# EAGLE design StepDown_V1 (EAGLE 6.1)
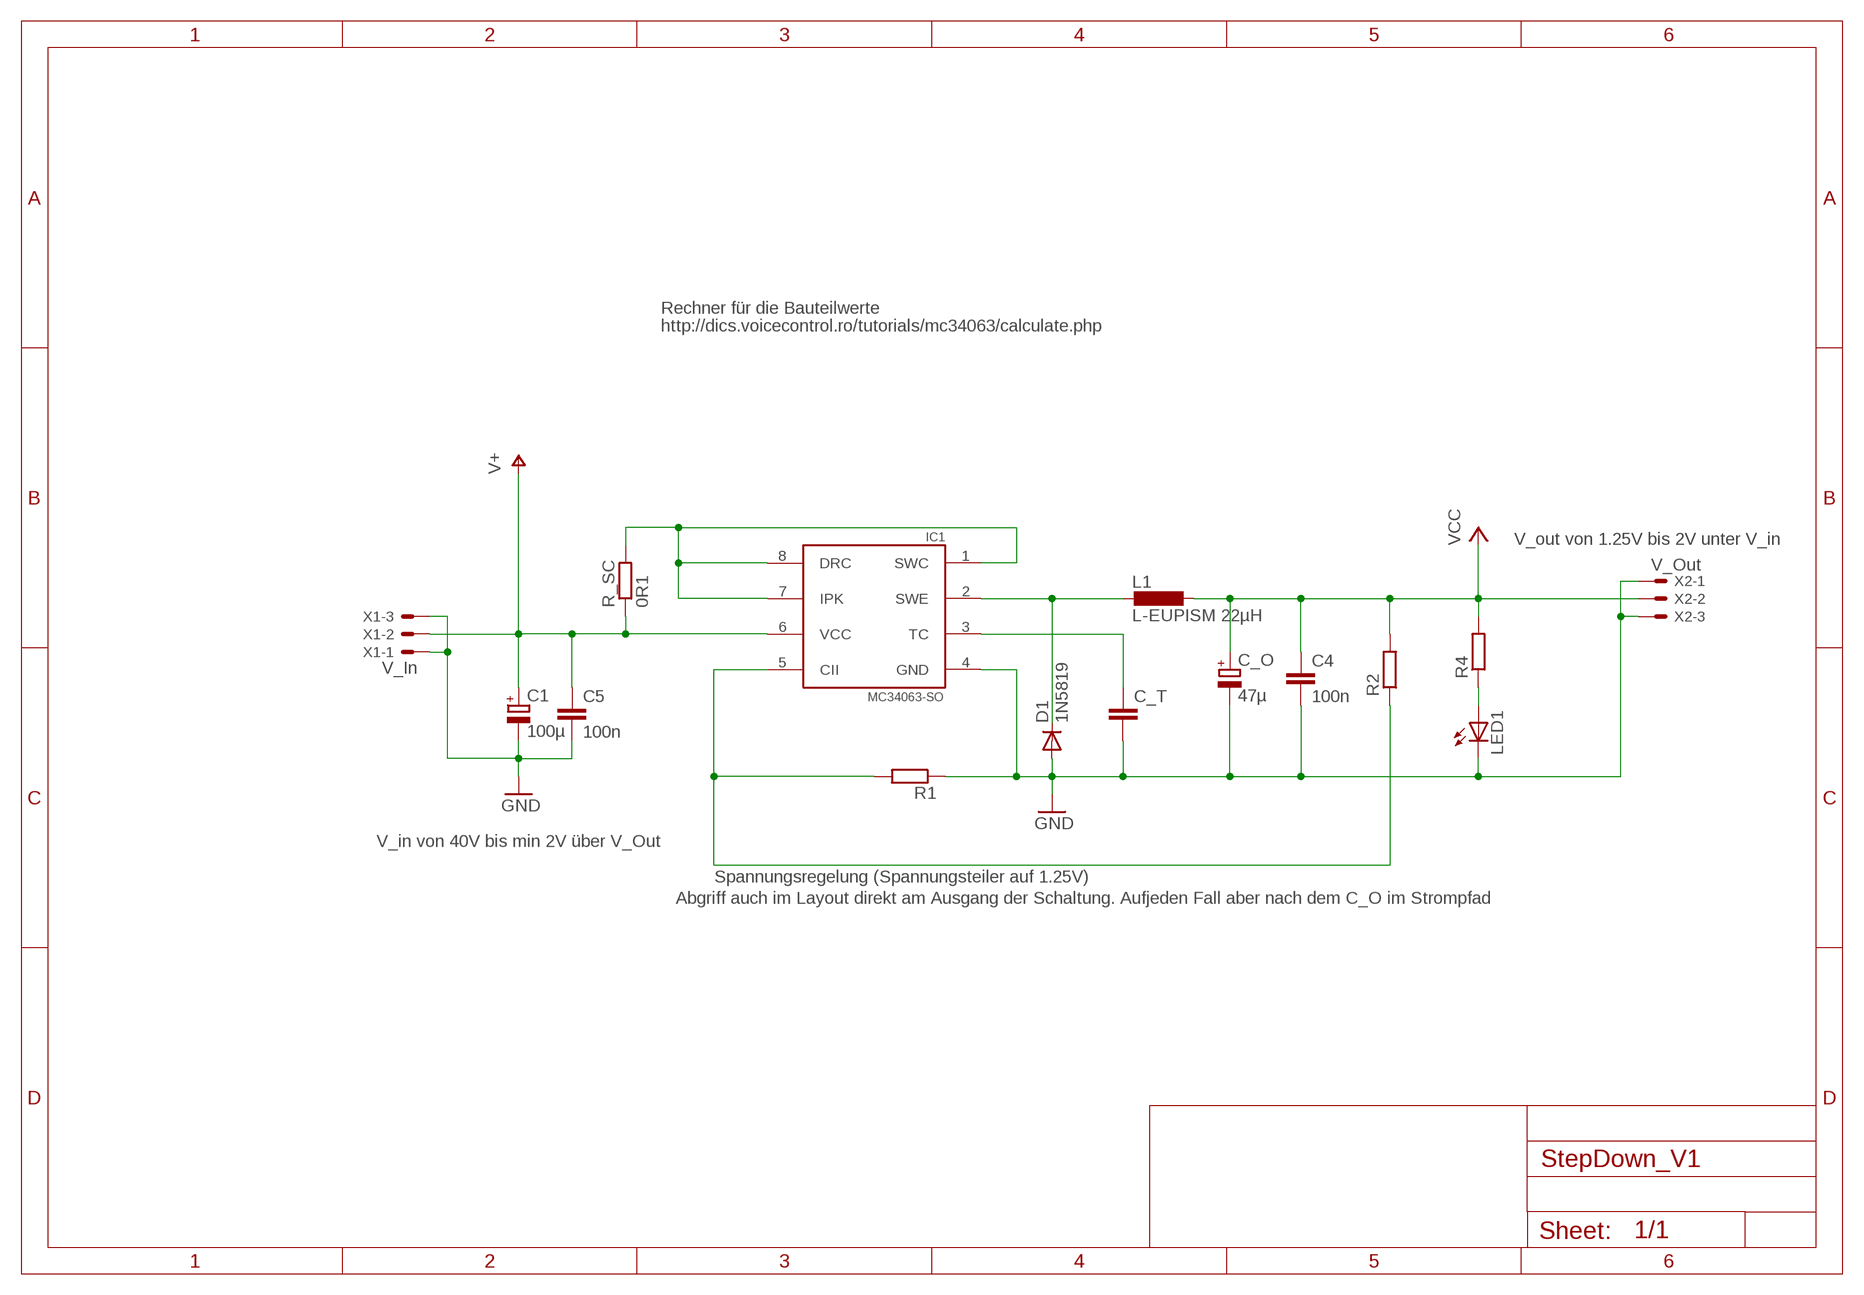
[diagram p0: schematic, sheet 1]

## Parts
C1  100µ  CPOL-EUE2.5-7  [E2,5-7]
C4  100n  C-EUC1206  [C1206]
C5  100n  C-EUC1206  [C1206]
C_O  47µ  CPOL-EUE2.5-7  [E2,5-7]
C_T  C-EUC1206  [C1206]
D1  1N5819  1N4933  [DO41-10]
IC1  MC34063-SO  [SO8]
L1  L-EUPISM 22µH  L-EUPISM  [PISM]
LED1  LEDSML1206  [SML1206]
R1  R-EU_R1206  [R1206]
R2  R-EU_R1206  [R1206]
R4  R-EU_R1206  [R1206]
R_SC  0R1  R-EU_R1206  [R1206]
X1  V_In  22-23-2031  [22-23-2031]
X2  V_Out  22-23-2031  [22-23-2031]

## Nets
GND: C1.- C4.2 C5.2 C_O.- C_T.2 D1.A IC1.4(GND) LED1.C R1.1 X1.1 X1.3 X2.1 X2.3
N$1: IC1.1(SWC) IC1.7(IPK) IC1.8(DRC) R_SC.2
N$2: D1.C IC1.2(SWE) L1.2
N$3: LED1.A R4.1
N$4: IC1.5(CII) R1.2 R2.1
N$6: C_T.1 IC1.3(TC)
V+: C1.+ C5.1 IC1.6(VCC) R_SC.1 X1.2
VCC: C4.1 C_O.+ L1.1 R2.2 R4.2 X2.2

## Notes on the sheet
- Rechner für die Bauteilwerte
- http://dics.voicecontrol.ro/tutorials/mc34063/calculate.php
- V_out von 1.25V bis 2V unter V_in
- V_in von 40V bis min 2V über V_Out
- Spannungsregelung (Spannungsteiler auf 1.25V)
- Abgriff auch im Layout direkt am Ausgang der Schaltung. Aufjeden Fall aber nach dem C_O im Strompfad

## Library data of the parts
C1 C_O = rcl:CPOL-EU: POLARIZED CAPACITOR, European symbol
C4 C5 C_T = rcl:C-EU: CAPACITOR, European symbol
D1 = diode:1N4933: DIODE fast recovery rectifier, 1A
IC1 = mc34063:MC34063-SO: DC/DC converter MC34063 in SO08.
L1 = Inductor-Fastron:L-EU
LED1 = led:LED: LED OSRAM: - CHIPLED LG R971, LG N971, LY N971, LG Q971, LY Q971, LO R971, LY R971 LH N974, LH R974 LS Q976, LO Q976, LY Q976 LO Q996 - Hyper CHIPLED LW Q18S LB Q993, LB Q99A, LB R99A - SideLED LS A670, LO A670, LY A670, LG A670, LP A670 LB A673, LV A673, LT A673, LW A673 LH A674 LY A675 LS A676, LA A676, LO A676, LY A676, LW A676 LS A679, LY A679, LG A679 - Hyper Micro SIDELED® LS Y876, LA Y876, LO Y876, LY Y876 LT Y87S - SmartLED LW L88C, LW L88S LB L89C, LB L89S, LG L890 LS L89K, LO L89K, LY L89K LS L896, LA L896, LO L896, LY L896 - TOPLED LS T670, LO T670, LY T670, LG T670, LP T670 LSG T670, LSP T670, LSY T670, LOP T670, LYG T670 LG T671, LOG T671, LSG T671 LB T673, LV T673, LT T673, LW T673 LH T674 LS T676, LA T676, LO T676, LY T676, LB T676, LH T676, LSB T676, LW T676 LB T67C, LV T67C, LT T67C, LS T67K, LO T67K, LY T67K, LW E67C LS E67B, LA E67B, LO E67B, LY E67B, LB E67C, LV E67C, LT E67C LW T67C LS T679, LY T679, LG T679 LS T770, LO T770, LY T770, LG T770, LP T770 LB T773, LV T773, LT T773, LW T773 LH T774 LS E675, LA E675, LY E675, LS T675 LS T776, LA T776, LO T776, LY T776, LB T776 LHGB T686 LT T68C, LB T68C - Hyper Mini TOPLED® LB M676 - Mini TOPLED Santana® LG M470 LS M47K, LO M47K, LY M47K Source: http://www.osram.convergy.de LUXEON: - LUMILED® LXK2-PW12-R00, LXK2-PW12-S00, LXK2-PW14-U00, LXK2-PW14-V00 LXK2-PM12-R00, LXK2-PM12-S00, LXK2-PM14-U00 LXK2-PE12-Q00, LXK2-PE12-R00, LXK2-PE12-S00, LXK2-PE14-T00, LXK2-PE14-U00 LXK2-PB12-K00, LXK2-PB12-L00, LXK2-PB12-M00, LXK2-PB14-N00, LXK2-PB14-P00, LXK2-PB14-Q00 LXK2-PR12-L00, LXK2-PR12-M00, LXK2-PR14-Q00, LXK2-PR14-R00 LXK2-PD12-Q00, LXK2-PD12-R00, LXK2-PD12-S00 LXK2-PH12-R00, LXK2-PH12-S00 LXK2-PL12-P00, LXK2-PL12-Q00, LXK2-PL12-R00 Source: www.luxeon.com KINGBRIGHT: KA-3528ASYC Source: www.kingbright.com
R1 R2 R4 R_SC = rcl:R-EU_: RESISTOR, European symbol
X1 X2 = con-molex:22-23-2031: .100" (2.54mm) Center Header - 3 Pin; MF: MOLEX; MPN: 22-23-2031; OC_FARNELL: 1462950; OC_NEWARK: 30C0862

## Board
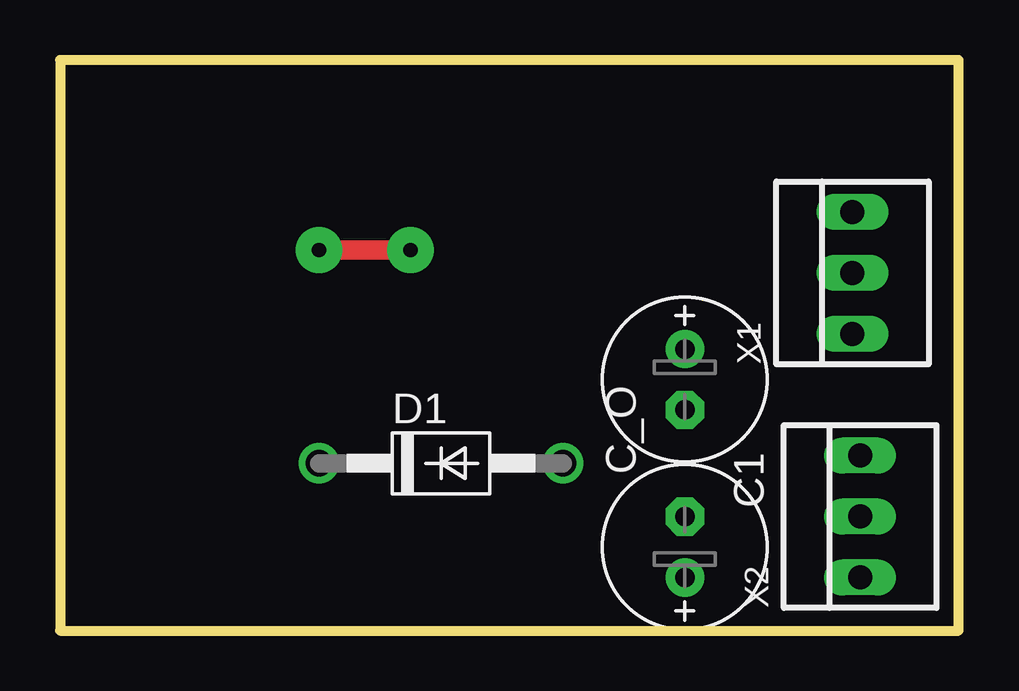
[diagram p1: board, top side]
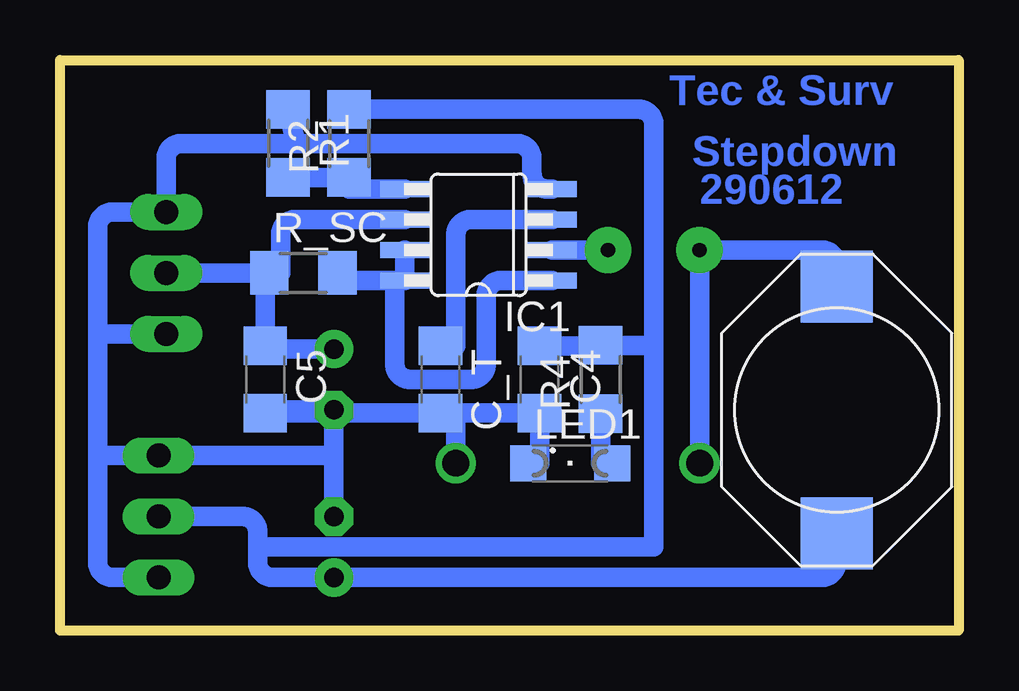
[diagram p2: board, bottom side, seen from below]

Size 37.45 x 23.8 mm. Coordinates in mm from the lower left corner, seen from the top.
Outline: 0,0 37.45,0 37.45,23.8 0,23.8 0,0
Copper layers (1*16): Top 0.035mm / dielectric 1.5mm / Bottom 0.035mm
Design rules: minimum track width 10mil, minimum drill 24mil, track to track 8mil, track to pad 8mil, pad to pad 8mil, via to via 8mil, smd to smd 8mil, copper to edge 40mil, drill to drill 8mil, minimum pad ring 10mil, minimum via ring 8mil, stop-mask expansion 4mil, vias tented up to drill 0mil, thermal gap 10mil

### Footprints (pad centres in the part's own frame; a part is rotated, then mirrored left to right if it is on the bottom)
E2,5-7 = drill 0.813 pad 1.6: + -1.27,0 | drill 0.813 pad 1.6 octagon: - 1.27,0
C1206 = smd 1.6 x 1.8: 1 -1.4,0; 2 1.4,0
DO41-10 = drill 1.118: A 5.08,0; C -5.08,0
SO8 = smd 0.66 x 2.032: 1 -1.905,-3.073; 2 -0.635,-3.073; 3 0.635,-3.073; 4 1.905,-3.073; 5 1.905,3.073; 6 0.635,3.073; 7 -0.635,3.073; 8 -1.905,3.073
PISM = smd 3 x 3: 1 -5.15,0; 2 5.15,0
SML1206 = smd 1.5 x 1.5: A 1.75,0; C -1.75,0
R1206 = smd 1.6 x 1.803: 1 -1.422,0; 2 1.422,0
22-23-2031 = drill 1 long: 1 -2.54,0; 2 0,0; 3 2.54,0

### Placement (x,y rotation side)
C1  26.04,10.48 270 top
C4  17.46,10.48 270 bottom
C5  28.89,10.48 270 bottom
C_O  26.04,3.49 90 top
C_T  21.59,10.48 270 bottom
D1  15.88,6.99 0 top
IC1  20,16.51 90 bottom
L1  5.08,9.21 90 bottom
LED1  16.19,6.99 0 bottom
R1  27.94,20.32 270 bottom
R2  25.4,20.32 90 bottom
R4  14.92,10.48 90 bottom
R_SC  27.3,14.92 0 bottom
X1  33.02,14.92 90 top
X2  33.34,4.76 90 top

### Tracks (layer width: path | path; a pad name or v marks a point on that pad's centre or on a via)
GND
  Bottom 0.813: X2.1 35.24,2.22 arc90 35.88,2.86 35.88,7.3 | 35.88,7.3 X2.3 26.04,7.3 | 35.88,12.38 35.88,16.83 arc90 35.24,17.46 X1.3 33.02,19.68 arc90 32.38,20.32 27.62,20.32 | 35.88,12.38 35.88,7.3 | 26.04,7.3 C1.- 28.89,9.21 C5.2 C_T.2 | 26.04,7.3 C_O.- | X1.1 35.88,12.38 | LED1.C 17.46,6.99 C4.2 C_T.2 | D1.A 20.95,9.08 C_T.2 | IC1.4 17.14,18.41 arc90 17.78,19.05 17.78,19.68 arc-90 18.41,20.32 27.62,20.32 | R1.1 27.62,20.32
N$1
  Bottom 0.813: IC1.7 IC1.8 23.5,14.61 | 23.5,14.61 26.04,14.61 26.04,14.92 R_SC.2 | IC1.1 19.05,14.61 arc-90 19.68,13.97 19.68,11.11 arc90 20.32,10.48 22.86,10.48 arc90 23.5,11.11 23.5,14.61
N$2  (via drill 0.6 pad 1.93)
  Top 0.813: v14.61,15.88 v10.79,15.88
  Bottom 0.813: L1.2 5.08,15.24 arc-90 5.71,15.88 v10.79,15.88 D1.C | IC1.2 v14.61,15.88
N$3
  Bottom 0.813: LED1.A 14.92,6.99 R4.1
N$4
  Bottom 0.813: IC1.5 25.4,18.41 R2.1 R1.2
N$6
  Bottom 0.813: IC1.3 20.32,17.14 arc-90 20.95,16.51 20.95,11.88 C_T.1
V+
  Bottom 0.813: IC1.6 27.62,17.14 arc-90 28.26,16.51 28.26,14.92 R_SC.1 | C1.+ 28.89,11.75 C5.1 28.89,14.92 R_SC.1 | X1.2 R_SC.1
VCC
  Bottom 0.813: L1.1 5.08,2.86 arc90 5.71,2.22 C_O.+ 28.57,2.22 arc90 29.21,2.86 29.21,3.49 | 29.21,3.49 29.21,4.13 arc-90 29.84,4.76 X2.2 | C4.1 16.19,11.88 R4.2 12.7,11.9 | R2.2 13.34,21.74 arc90 12.7,21.11 12.7,11.9 | 12.7,11.9 12.7,3.49 29.21,3.49

### Text on the board
Bottom: Tec & Surv | Stepdown | 290612